# Altium project radxa_cm3_io_board_v1360_schematic.PrjPcb (part 2 of 5)

## Sheet 09.LCD_eDP TX.SchDoc: CM3 IO
size 297 x 209 mm; Page Create Date: March  8, 1995; Page Number: 09; Page Size: A4; Comment: radxa_1010; Page Count: 20; RevCode: 1.36; Doc: LCD_eDP TX; DsnPath: D:\WMS\黄工\[RC119]CM3_IO_V1.36\对外资料\radxa_cm3_io_board_v1360.DSN; SchematicName: CM3_IO V1.36; PageName: 09.LCD_eDP TX; PageSize: A4; TopSchematic: True
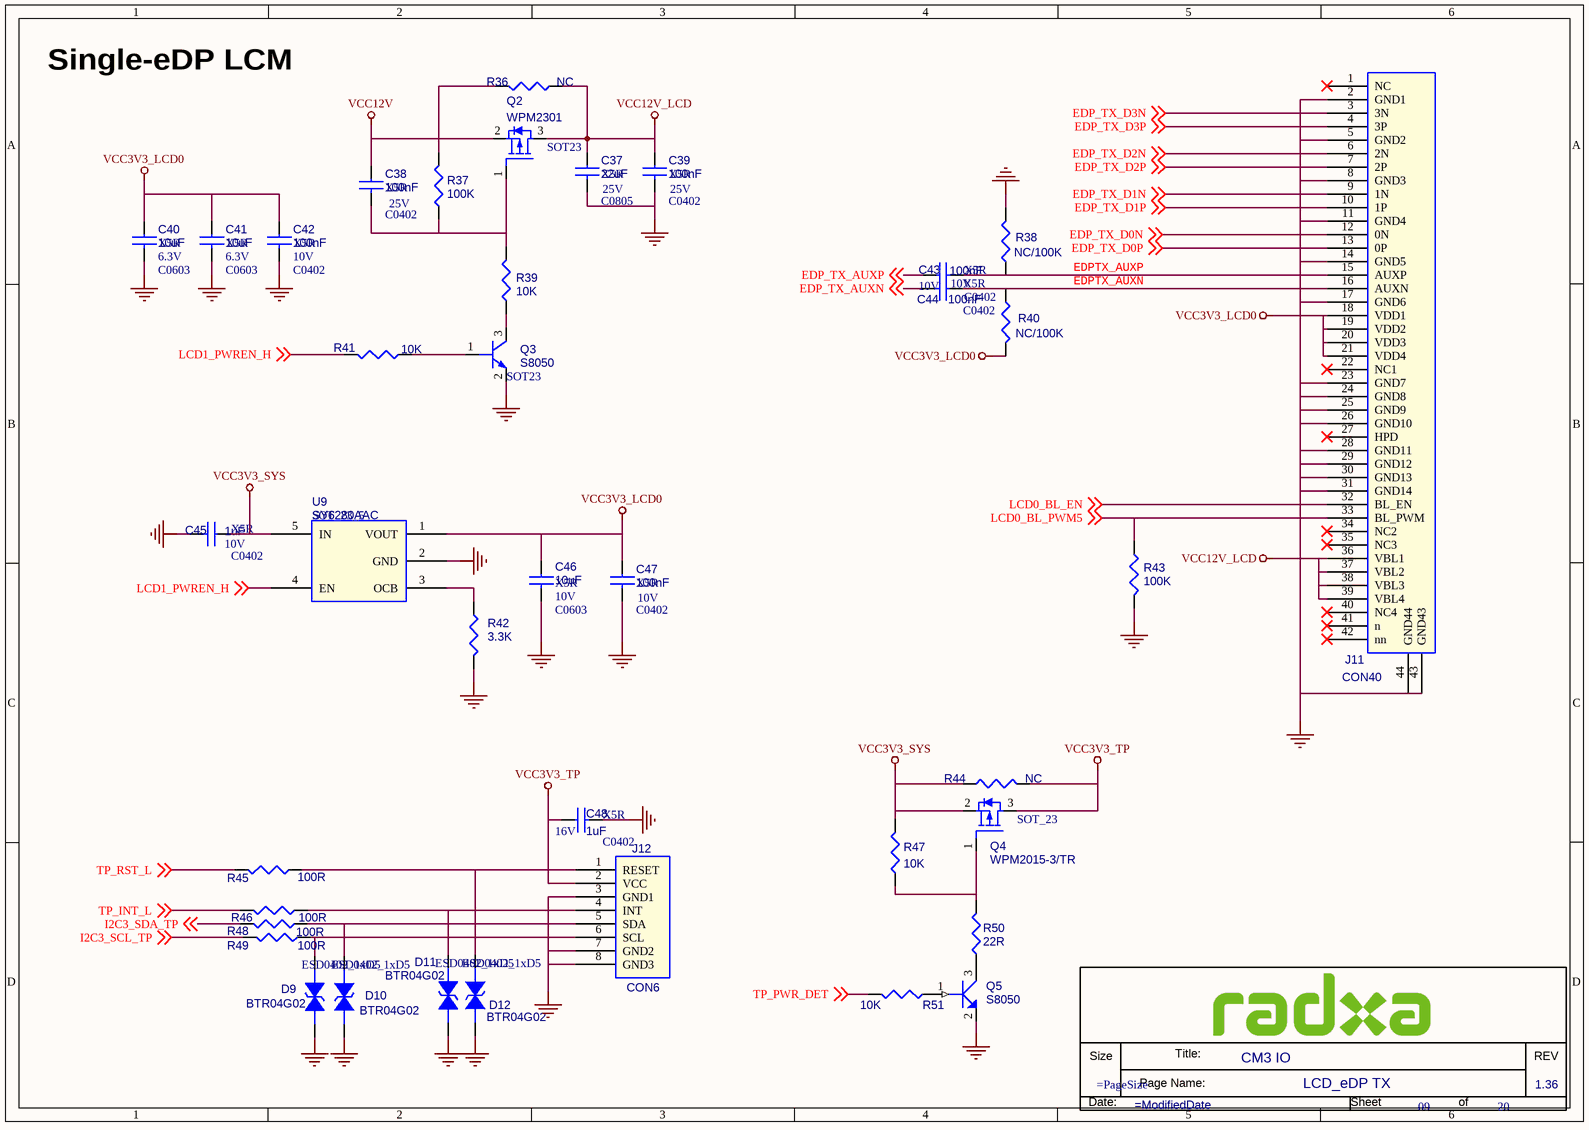
[diagram p7: 09.LCD_eDP TX.SchDoc]

### Parts
(Parts that share a designator on the sheet are numbered #1, #2 ... from top to bottom, then left to right.)
*#8  Doc: LCD_eDP TX  RevCode: 1.36  Title: CM3 IO  Page Number: 09  Page Count: 20  (hidden comment: radxa_1010)  (graphical)
C37  22uF  Voltage: 25V  Dielectric: X5R  [C0805]
C38  100nF  Voltage: 25V  Dielectric: X5R  [C0402]
C39  100nF  Voltage: 25V  Dielectric: X5R  [C0402]
C40  10uF  Voltage: 6.3V  Dielectric: X5R  [C0603]
C41  10uF  Voltage: 6.3V  Dielectric: X5R  [C0603]
C42  100nF  Voltage: 10V  Dielectric: X5R  [C0402]
C43  100nF  Voltage: 10V  Dielectric: X5R  [C0402]
C44  100nF  Voltage: 10V  Dielectric: X5R  [C0402]
C45  1uF  Voltage: 10V  Dielectric: X5R  [C0402]
C46  10uF  Voltage: 10V  Dielectric: X5R  [C0603]
C47  100nF  Voltage: 10V  Dielectric: X5R  [C0402]
C48  1uF  Voltage: 16V  Dielectric: X5R  [C0402]
D9  BTR04G02  [ESD0402_1xD5]
D10  BTR04G02  [ESD0402_1xD5]
D11  BTR04G02  [ESD0402_1xD5]
D12  BTR04G02  [ESD0402_1xD5]
J11  CON40  [20455-040E-TOP]
J12  CON6  [FPC6-0.5MM-2660H]
Q2  WPM2301  [SOT23]
Q3  S8050  [SOT23]
Q4  WPM2015-3/TR  PCB Footprint: SOT_23  [SOT23]
Q5  S8050  [SOT23]
R36  NC  [R0603]
R37  100K  [R0402]
R38  NC/100K  [R0402]
R39  10K  [R0402]
R40  NC/100K  [R0402]
R41  10K  [R0402]
R42  3.3K  [R0402]
R43  100K  [R0402]
R44  NC  [R0402]
R45  100R  [R0402]
R46  100R  [R0402]
R47  10K  [R0402]
R48  100R  [R0402]
R49  100R  [R0402]
R50  22R  [R0402]
R51  10K  [R0402]
U9  SY6280AAC  [SOT_23_5]

### Nets
GND: C37.2 C39.2 C40.2 C41.2 C42.2 C45.2 C46.2 C47.2 C48.2 D9.1 D10.1 D11.1 D12.1 J11.2(GND1) J11.5(GND2) J11.8(GND3) J11.11(GND4) J11.14(GND5) J11.17(GND6) J11.23(GND7) J11.24(GND8) J11.25(GND9) J11.26(GND10) J11.28(GND11) J11.29(GND12) J11.30(GND13) J11.31(GND14) J11.43(GND43) J11.44(GND44) J12.3(GND1) J12.7(GND2) J12.8(GND3) Q3.2(EMITTER) Q5.2(E) R38.1 R42.2 R43.2 U9.2(GND)
VCC3V3_LCD0: C40.1 C41.1 C42.1 C46.1 C47.1 J11.18(VDD1) J11.19(VDD2) J11.20(VDD3) J11.21(VDD4) R40.2 U9.1(VOUT)
VCC3V3_SYS: C45.1 Q4.2(SOURCE) R44.1 R47.2 U9.5(IN)
VCC3V3_TP: C48.1 J12.2(VCC) Q4.3(DRAIN) R44.2
VCC12V: C38.1 Q2.2(SOURCE) R36.1 R37.1
VCC12V_LCD: C37.1 C39.1 J11.36(VBL1) J11.37(VBL2) J11.38(VBL3) J11.39(VBL4) Q2.3(DRAIN) R36.2
EDP_TX_AUXN: C44.2 ; off-sheet EDP_TX_AUXN
EDP_TX_AUXP: C43.1 ; off-sheet EDP_TX_AUXP
EDP_TX_D0N: J11.12(0N) ; off-sheet EDP_TX_D0N
EDP_TX_D0P: J11.13(0P) ; off-sheet EDP_TX_D0P
EDP_TX_D1N: J11.9(1N) ; off-sheet EDP_TX_D1N
EDP_TX_D1P: J11.10(1P) ; off-sheet EDP_TX_D1P
EDP_TX_D2N: J11.6(2N) ; off-sheet EDP_TX_D2N
EDP_TX_D2P: J11.7(2P) ; off-sheet EDP_TX_D2P
EDP_TX_D3N: J11.3(3N) ; off-sheet EDP_TX_D3N
EDP_TX_D3P: J11.4(3P) ; off-sheet EDP_TX_D3P
EDPTX_AUXN: C44.1 J11.16(AUXN) R40.1
EDPTX_AUXP: C43.2 J11.15(AUXP) R38.2
I2C3_SCL_TP: R49.1 ; off-sheet I2C3_SCL_TP
I2C3_SDA_TP: R48.1 ; off-sheet I2C3_SDA_TP
LCD0_BL_EN: J11.32(BL_EN) ; off-sheet LCD0_BL_EN
LCD0_BL_PWM5: J11.33(BL_PWM) R43.1 ; off-sheet LCD0_BL_PWM5
LCD1_PWREN_H: R41.1 U9.4(EN) ; off-sheet LCD1_PWREN_H
TP_INT_L: R46.1 ; off-sheet TP_INT_L
TP_PWR_DET: R51.2 ; off-sheet TP_PWR_DET
TP_RST_L: R45.1 ; off-sheet TP_RST_L
NetC38_2: C38.2 Q2.1(GATE) R37.2 R39.1
NetD9_2: D9.2 J12.6(SCL) R49.2
NetD10_2: D10.2 J12.5(SDA) R48.2
NetD11_2: D11.2 J12.4(INT) R46.2
NetD12_2: D12.2 J12.1(RESET) R45.2
NetQ3_1: Q3.1(BASE) R41.2
NetQ3_3: Q3.3(COLLECTOR) R39.2
NetQ4_1: Q4.1(GATE) R47.1 R50.2
NetQ5_1: Q5.1(B) R51.1
NetQ5_3: Q5.3(C) R50.1
NetR42_1: R42.1 U9.3(OCB)

Not connected (* = marked no-connect by the designer): J11 1(NC)* 22(NC1)* 27(HPD)* 34(NC2)* 35(NC3)* 40(NC4)* 41(n)* 42(nn)*

### Notes on the sheet
- Single-eDP LCM
- (in symbol radxa_1010) Title:; Size; REV; Page Name:; Date:; Sheet; of

### Library data of the parts
C37 = CAP NP_0: cap,10.00uF,+/-10%,6.3V,X5R,C0603; Part Reference: C37; Manufacturer PN: C1608X5R0J106K080AB; Manufacturer: TDK; Tolerance: 10%; Priority: A; PCB Footprint: C0805; Value: 22uF; Created by: JJJ; Part Type: C0603; RK PN: C1608X5R0J106K080AB
C38 = CAP NP_0: cap,100.00nF,+/-10%,16V,X5R,C0402; Part Reference: C38; Manufacturer: TDK; RK PN: C1005X5R1C104K050BA; Priority: A; Tolerance: 10%; PCB Footprint: C0402; Value: 100nF; Part Type: C0402; Manufacturer PN: C1005X5R1C104K050BA; Created by: JJJ
C39 = CAP NP_0: cap,100.00nF,+/-10%,16V,X5R,C0402; Part Reference: C39; Manufacturer PN: C1005X5R1C104K050BA; Manufacturer: TDK; Tolerance: 10%; Priority: A; PCB Footprint: C0402; Value: 100nF; Created by: JJJ; Part Type: C0402; RK PN: C1005X5R1C104K050BA
C40 = CAP NP_0: cap,10.00uF,+/-10%,6.3V,X5R,C0603; Part Reference: C40; Manufacturer: TDK; RK PN: C1608X5R0J106K080AB; Priority: A; Tolerance: 10%; PCB Footprint: C0603; Value: 10uF; Part Type: C0603; C_Voltage: 6.3V; Manufacturer PN: C1608X5R0J106K080AB; Created by: JJJ
C41 = CAP NP_0: cap,10.00uF,+/-10%,6.3V,X5R,C0603; Part Reference: C41; Manufacturer: TDK; RK PN: C1608X5R0J106K080AB; Priority: A; Tolerance: 10%; PCB Footprint: C0603; Value: 10uF; Part Type: C0603; C_Voltage: 6.3V; Manufacturer PN: C1608X5R0J106K080AB; Created by: JJJ
C42 = CAP NP_0: cap,100.00nF,+/-10%,10V,X5R,C0402; Part Reference: C42; Manufacturer PN: C1005X5R1A104K050BA; Manufacturer: TDK; Tolerance: 10%; Priority: A; PCB Footprint: C0402; Value: 100nF; Created by: JJJ; Part Type: C0402; RK PN: C1005X5R1A104K050BA
C43 = CAP NP_0: cap,100.00nF,+/-10%,10V,X5R,C0402; Part Reference: C43; Manufacturer PN: C1005X5R1A104K050BA; Manufacturer: TDK; Tolerance: 10%; Priority: A; PCB Footprint: C0402; Value: 100nF; Created by: JJJ; Part Type: C0402; RK PN: C1005X5R1A104K050BA
C44 = CAP NP_0: cap,100.00nF,+/-10%,10V,X5R,C0402; Part Reference: C44; Manufacturer PN: C1005X5R1A104K050BA; Manufacturer: TDK; Tolerance: 10%; Priority: A; PCB Footprint: C0402; Value: 100nF; Created by: JJJ; Part Type: C0402; RK PN: C1005X5R1A104K050BA
C45 = CAP NP_0: cap,1.00uF,+/-10%,10V,X5R,C0402; Part Reference: C45; Manufacturer PN: C1005X5R1A105K050BB; Manufacturer: TDK; Tolerance: 10%; C_Voltage: 6.3V; Priority: A; PCB Footprint: C0402; Value: 1uF; Created by: JJJ; Part Type: C0402; RK PN: C1005X5R1A105K050BB
C46 = CAP NP_0: cap,10.00uF,+/-10%,10V,X5R,C0603; Part Reference: C46; Manufacturer: TDK; RK PN: C1608X5R1A106K080AC; Priority: A; Tolerance: 10%; PCB Footprint: C0603; Value: 10uF; Part Type: C0603; Manufacturer PN: C1608X5R1A106K080AC; Created by: JJJ
C47 = CAP NP_0: cap,100.00nF,+/-10%,10V,X5R,C0402; Part Reference: C47; Manufacturer: TDK; RK PN: C1005X5R1A104K050BA; Priority: A; Tolerance: 10%; PCB Footprint: C0402; Value: 100nF; Part Type: C0402; Manufacturer PN: C1005X5R1A104K050BA; Created by: JJJ
C48 = CAP NP_0: cap,100.00nF,+/-10%,6.3V,X5R,C0402; Part Reference: C48; Manufacturer: TDK; RK PN: C1005X5R0J104K050BA; Priority: A; Tolerance: 10%; PCB Footprint: C0402; Value: 1uF; Part Type: C0402; Manufacturer PN: C1005X5R0J104K050BA; Created by: JJJ
D9 = DIODE BI_DIR TRIG_0: 1-Line, Bi-directional, Transient Voltage Suppressors.17.5pF.; Part Reference: D9; Manufacturer PN: ESD5451N; Manufacturer: WillSemi(韦尔半导体); OPTION: DNP; Priority: A; PCB Footprint: ESD0402_1xD5; Value: BTR04G02; Created by: JJJ; Part Type: ESD_TVS; RK PN: ESD5451N
D10 = DIODE BI_DIR TRIG_0: 1-Line, Bi-directional, Transient Voltage Suppressors.17.5pF.; Part Reference: D10; Manufacturer: WillSemi(韦尔半导体); RK PN: ESD5451N; Priority: A; OPTION: DNP; PCB Footprint: ESD0402_1xD5; Value: BTR04G02; Part Type: ESD_TVS; Manufacturer PN: ESD5451N; Created by: JJJ
D11 = DIODE BI_DIR TRIG_0: 1-Line, Bi-directional, Transient Voltage Suppressors.17.5pF.; Part Reference: D11; Manufacturer: WillSemi(韦尔半导体); RK PN: ESD5451N; Priority: A; OPTION: DNP; PCB Footprint: ESD0402_1xD5; Value: BTR04G02; Part Type: ESD_TVS; Manufacturer PN: ESD5451N; Created by: JJJ
D12 = DIODE BI_DIR TRIG_0: 1-Line, Bi-directional, Transient Voltage Suppressors.17.5pF.; Part Reference: D12; Manufacturer: WillSemi(韦尔半导体); RK PN: ESD5451N; Priority: A; OPTION: DNP; PCB Footprint: ESD0402_1xD5; Value: BTR04G02; Part Type: ESD_TVS; Manufacturer PN: ESD5451N; Created by: JJJ
J11 = CON40_1: Part Reference: J11; Value: CON40; PCB Footprint: 20455-040E-TOP
J12 = CON6_1: Part Reference: J12; Value: CON6; PCB Footprint: FPC6-0.5MM-2660H
Q2 = MOSFET P: PMOS,WPM3407-3/TR,SOT_23,Id=4.4A,Vds=30V; Part Reference: Q2; Manufacturer: WillSemi(韦尔半导体); Priority: A; Id_max: 4.4A; Vgs: ±20V; VDS: 30V; Vgsth: 2.0V; Pd: 0.9W; PCB Footprint: SOT23; Value: WPM2301; RK PN: WPM3407-3/TR; Part Type: PMOS; Manufacturer PN: WPM3407-3/TR; Created by: JJJ
Q3 = NPN: S8050,SOT23; Part Reference: Q3; Manufacturer: 长电; Manufacturer PN: S8050_SOT23; Priority: A; Ic: 0.5A; Vceo: 25V; Pc: 0.3W; PCB Footprint: SOT23; Value: S8050; RK PN: S8050; Part Type: NPN; Created by: JJJ
Q4 = MOSFET P: PMOS,WPM2015-3/TR,SOT_23,Id=2.4A,Vds=20V; Part Reference: Q4; Manufacturer: WillSemi(韦尔半导体); ROOM: CHG; Priority: A; Id_max: 2.4A; Vgs: ±8V; VDS: 20V; Vgsth: 0.62V; Pd: 0.5W; option: DNP; Value: WPM2015-3/TR; RK PN: WPM2015-3/TR; Part Type: PMOS; Manufacturer PN: WPM2015-3/TR; Created by: JJJ
Q5 = NPN4: Part Reference: Q5; Value: S8050; PCB Footprint: SOT23
R36 = RESISTOR_0: 通用厚膜电阻,10K,+/-5%,R0402,1/16W.; Part Reference: R36; Manufacturer: YAGEO; RK PN: RC0402JR-0710KL; Priority: A; Tolerance: 5%; Wattage: 1/16W; Value: NC; Part Type: 通用厚膜电阻; Manufacturer PN: RC0402JR-0710KL; Created by: YTL; PCB Footprint: R0603
R37 = RESISTOR_0: 通用厚膜电阻,100K,+/-5%,R0402,1/16W.; Part Reference: R37; Manufacturer: YAGEO; RK PN: RC0402JR-07100KL; Priority: A; Tolerance: 5%; Wattage: 1/16W; Value: 100K; Part Type: 通用厚膜电阻; Manufacturer PN: RC0402JR-07100KL; Created by: YTL; PCB Footprint: R0402
R38 = RESISTOR_0: 通用厚膜电阻,100K,+/-5%,R0402,1/16W.; Part Reference: R38; Manufacturer PN: RC0402JR-07100KL; Manufacturer: YAGEO; Option: DNP; Wattage: 1/16W; Tolerance: 5%; Priority: A; Value: NC/100K; Created by: YTL; Part Type: 通用厚膜电阻; RK PN: RC0402JR-07100KL; PCB Footprint: R0402
R39 = RESISTOR_0: 通用厚膜电阻,10K,+/-5%,R0402,1/16W.; Part Reference: R39; Manufacturer PN: RC0402JR-0710KL; Manufacturer: YAGEO; Wattage: 1/16W; Tolerance: 5%; Priority: A; Value: 10K; Created by: YTL; Part Type: 通用厚膜电阻; RK PN: RC0402JR-0710KL; PCB Footprint: R0402
R40 = RESISTOR_0: 通用厚膜电阻,100K,+/-5%,R0402,1/16W.; Part Reference: R40; Manufacturer: YAGEO; Option: DNP; RK PN: RC0402JR-07100KL; Priority: A; Tolerance: 5%; Wattage: 1/16W; Value: NC/100K; Part Type: 通用厚膜电阻; Manufacturer PN: RC0402JR-07100KL; Created by: YTL; PCB Footprint: R0402
R41 = RESISTOR_0: 通用厚膜电阻,10K,+/-5%,R0402,1/16W.; Part Reference: R41; Manufacturer: YAGEO; RK PN: RC0402JR-0710KL; Priority: A; Tolerance: 5%; Wattage: 1/16W; Value: 10K; Part Type: 通用厚膜电阻; Manufacturer PN: RC0402JR-0710KL; Created by: YTL; PCB Footprint: R0402
R42 = RESISTOR_0: 通用厚膜电阻,4K7,+/-5%,R0402,1/16W.; Part Reference: R42; Manufacturer PN: RC0402JR-074K7L; Manufacturer: YAGEO; Wattage: 1/16W; Tolerance: 5%; Priority: A; Value: 3.3K; Created by: YTL; Part Type: 通用厚膜电阻; RK PN: RC0402JR-074K7L; PCB Footprint: R0402
R43 = RESISTOR_0: 通用厚膜电阻,100K,+/-5%,R0402,1/16W.; Part Reference: R43; Manufacturer: YAGEO; RK PN: RC0402JR-07100KL; Priority: A; Tolerance: 5%; Wattage: 1/16W; Value: 100K; Part Type: 通用厚膜电阻; Manufacturer PN: RC0402JR-07100KL; Created by: YTL; PCB Footprint: R0402
R44 = RESISTOR_0: 通用厚膜电阻,0R,+/-5%,R0402,1/16W.; Part Reference: R44; Manufacturer: YAGEO; RK PN: RC0402JR-070RL; Priority: A; Tolerance: 5%; Wattage: 1/16W; Value: NC; Part Type: 通用厚膜电阻; Manufacturer PN: RC0402JR-070RL; Created by: YTL; PCB Footprint: R0402
R45 = RESISTOR_0: 通用厚膜电阻,100K,+/-5%,R0402,1/16W.; Part Reference: R45; Manufacturer: YAGEO; RK PN: RC0402JR-07100KL; Priority: A; Tolerance: 5%; Wattage: 1/16W; Value: 100R; Part Type: 通用厚膜电阻; Manufacturer PN: RC0402JR-07100KL; Created by: YTL; PCB Footprint: R0402
R46 = RESISTOR_0: 通用厚膜电阻,100K,+/-5%,R0402,1/16W.; Part Reference: R46; Manufacturer PN: RC0402JR-07100KL; Manufacturer: YAGEO; Wattage: 1/16W; Tolerance: 5%; Priority: A; Value: 100R; Created by: YTL; Part Type: 通用厚膜电阻; RK PN: RC0402JR-07100KL; PCB Footprint: R0402
R47 = RESISTOR_0: 通用厚膜电阻,10K,+/-5%,R0402,1/16W.; Part Reference: R47; Manufacturer PN: RC0402JR-0710KL; Manufacturer: YAGEO; Wattage: 1/16W; Tolerance: 5%; Priority: A; Value: 10K; Created by: YTL; Part Type: 通用厚膜电阻; RK PN: RC0402JR-0710KL; PCB Footprint: R0402
R48 = RESISTOR_0: 通用厚膜电阻,100K,+/-5%,R0402,1/16W.; Part Reference: R48; Manufacturer PN: RC0402JR-07100KL; Manufacturer: YAGEO; Wattage: 1/16W; Tolerance: 5%; Priority: A; Value: 100R; Created by: YTL; Part Type: 通用厚膜电阻; RK PN: RC0402JR-07100KL; PCB Footprint: R0402
R49 = RESISTOR_0: 通用厚膜电阻,100K,+/-5%,R0402,1/16W.; Part Reference: R49; Manufacturer: YAGEO; RK PN: RC0402JR-07100KL; Priority: A; Tolerance: 5%; Wattage: 1/16W; Value: 100R; Part Type: 通用厚膜电阻; Manufacturer PN: RC0402JR-07100KL; Created by: YTL; PCB Footprint: R0402
R50 = RESISTOR_0: Part Reference: R50; Value: 22R; PCB Footprint: R0402
R51 = RESISTOR_0: 通用厚膜电阻,100K,+/-5%,R0402,1/16W.; Part Reference: R51; Manufacturer PN: RC0402JR-07100KL; Manufacturer: YAGEO; Wattage: 1/16W; Tolerance: 5%; Priority: A; Value: 10K; Created by: YTL; Part Type: 通用厚膜电阻; RK PN: RC0402JR-07100KL; PCB Footprint: R0402
U9 = SWITCH_SY6280: Low Loss Power Distribution Switch; Part Reference: U9; Manufacturer: Silergy（矽力杰）; Priority: A; PCB Footprint: SOT_23_5; Value: SY6280AAC; Created by: JJJ; Manufacturer PN: SY6280AAC; Part Type: Switch; RK PN: SY6280AAC
*#8 = radxa_1010: Page Create Date: March  8, 1995; Page Size: =PageSize; Page Modify Date: =ModifiedDate

## Sheet 10.MIPI_LCD_TX0.SchDoc: CM3 IO
size 297 x 209 mm; Page Create Date: March  8, 1995; Page Number: 10; Page Size: A4; Comment: radxa_1010; Page Count: 20; RevCode: 1.36; Doc: MIPI_LCD_TX0; DsnPath: D:\WMS\黄工\[RC119]CM3_IO_V1.36\对外资料\radxa_cm3_io_board_v1360.DSN; SchematicName: CM3_IO V1.36; PageName: 10.MIPI_LCD_TX0; PageSize: A4; TopSchematic: True
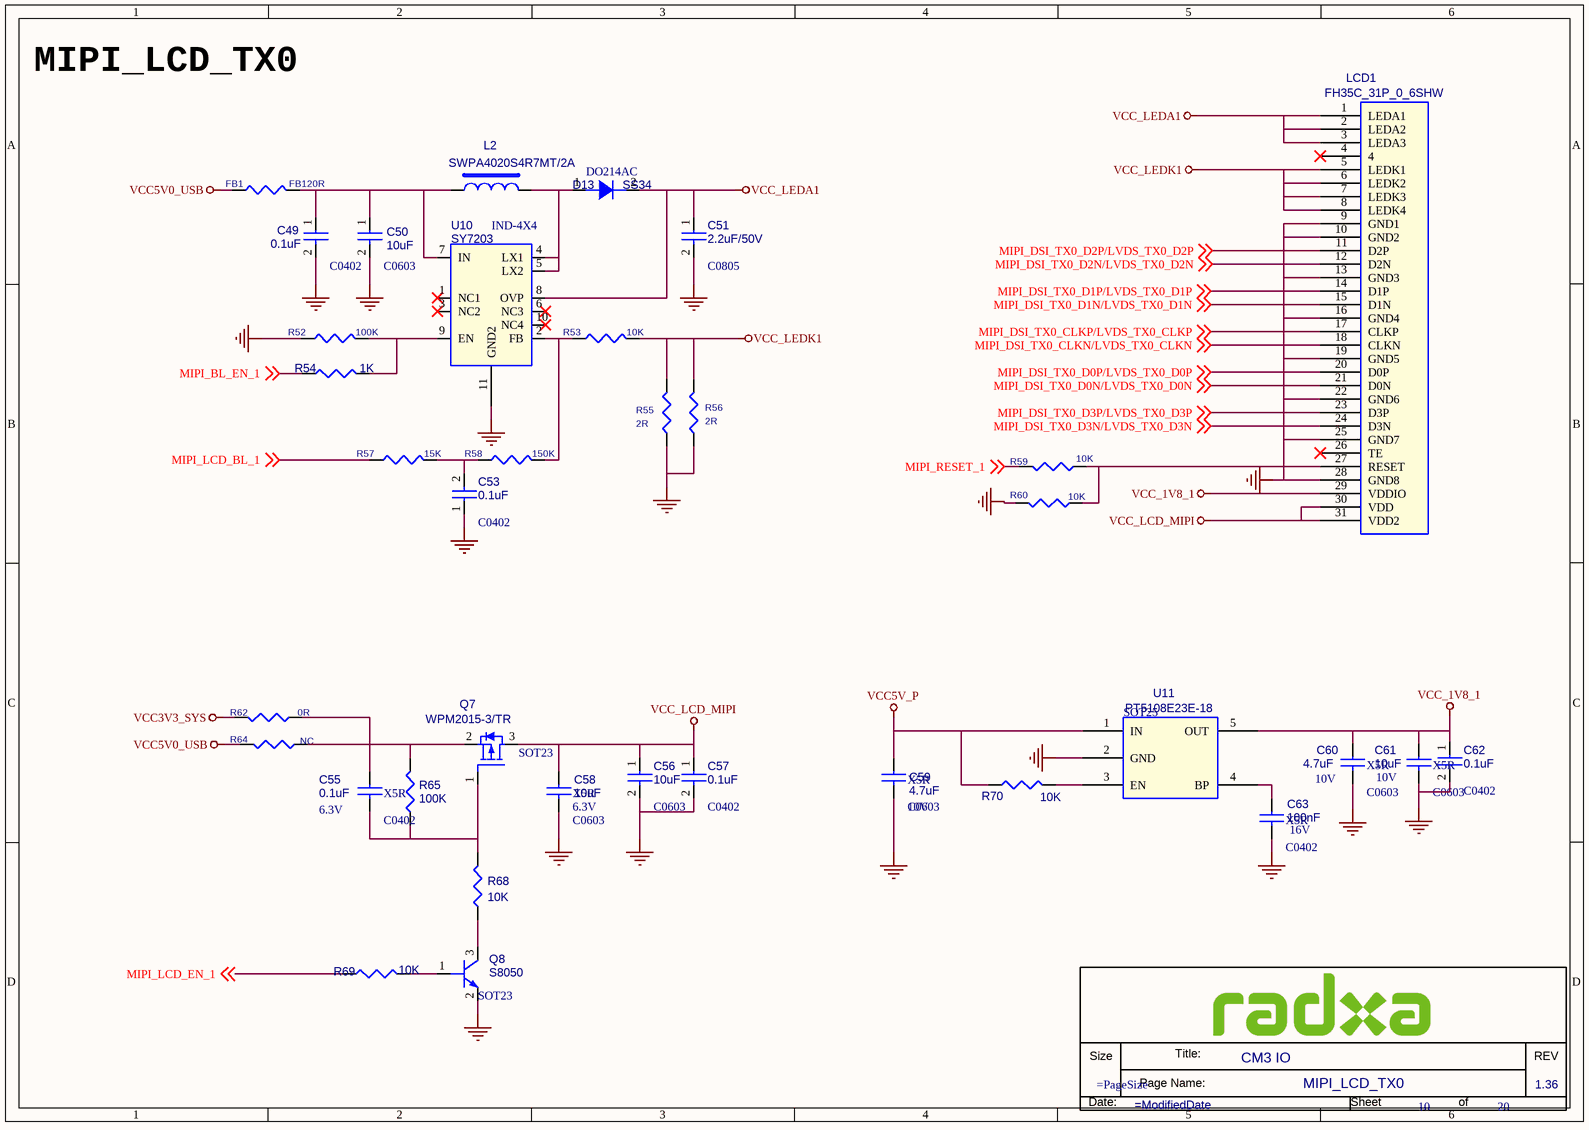
[diagram p8: 10.MIPI_LCD_TX0.SchDoc]

### Parts
(Parts that share a designator on the sheet are numbered #1, #2 ... from top to bottom, then left to right.)
*#9  Doc: MIPI_LCD_TX0  RevCode: 1.36  Title: CM3 IO  Page Number: 10  Page Count: 20  (hidden comment: radxa_1010)  (graphical)
C49  0.1uF  [C0402]
C50  10uF  [C0603]
C51  2.2uF/50V  [C0805]
C53  0.1uF  [C0402]
C55  0.1uF  Voltage: 6.3V  Dielectric: X5R  [C0402]
C56  10uF  [C0603]
C57  0.1uF  [C0402]
C58  10uF  Voltage: 6.3V  Dielectric: X5R  [C0603]
C59  4.7uF  Voltage: 10V  Dielectric: X5R  [C0603]
C60  4.7uF  Voltage: 10V  Dielectric: X5R  [C0603]
C61  10uF  Voltage: 10V  Dielectric: X5R  [C0603]
C62  0.1uF  [C0402]
C63  100nF  Voltage: 16V  Dielectric: X5R  [C0402]
D13  SS34  [DO214AC]
FB1  FB120R  [R0603]
L2  SWPA4020S4R7MT/2A  [IND-4X4]
LCD1  FH35C_31P_0_6SHW  [HQ101WX001]
Q7  WPM2015-3/TR  [SOT23]
Q8  S8050  [SOT23]
R52  100K  [R0402]
R53  10K  [R0402]
R54  1K  [R0402]
R55  2R  [R0805]
R56  2R  [R0805]
R57  15K  [R0402]
R58  150K  [R0402]
R59  10K  [R0402]
R60  10K  [R0402]
R62  0R  [R0603]
R64  NC  [R0603]
R65  100K  [R0402]
R68  10K  [R0402]
R69  10K  [R0402]
R70  10K  [R0402]
U10  SY7203  [QFN8-2X2]
U11  PT5108E23E-18  [SOT25]

### Nets
GND: C49.2 C50.2 C51.2 C53.1 C56.2 C57.2 C58.2 C59.2 C60.2 C61.2 C62.2 C63.2 LCD1.9(GND1) LCD1.10(GND2) LCD1.13(GND3) LCD1.16(GND4) LCD1.19(GND5) LCD1.22(GND6) LCD1.25(GND7) LCD1.28(GND8) Q8.2(EMITTER) R52.1 R55.2 R56.2 R60.2 U10.11(GND2) U11.2(GND)
VCC3V3_SYS: R62.1
VCC5V0_USB: FB1.1 R64.1
VCC5V_P: C59.1 R70.1 U11.1(IN)
VCC_1V8_1: C60.1 C61.1 C62.1 LCD1.29(VDDIO) U11.5(OUT)
VCC_LCD_MIPI: C56.1 C57.1 C58.1 LCD1.30(VDD) LCD1.31(VDD2) Q7.3(DRAIN)
VCC_LEDA1: C51.1 D13.2(K) LCD1.1(LEDA1) LCD1.2(LEDA2) LCD1.3(LEDA3) U10.8(OVP)
VCC_LEDK1: LCD1.5(LEDK1) LCD1.6(LEDK2) LCD1.7(LEDK3) LCD1.8(LEDK4) R53.2 R55.1 R56.1
MIPI_BL_EN_1: R54.1 ; off-sheet MIPI_BL_EN_1
MIPI_DSI_TX0_CLKN/LVDS_TX0_CLKN: LCD1.18(CLKN) ; off-sheet MIPI_DSI_TX0_CLKN/LVDS_TX0_CLKN
MIPI_DSI_TX0_CLKP/LVDS_TX0_CLKP: LCD1.17(CLKP) ; off-sheet MIPI_DSI_TX0_CLKP/LVDS_TX0_CLKP
MIPI_DSI_TX0_D0N/LVDS_TX0_D0N: LCD1.21(D0N) ; off-sheet MIPI_DSI_TX0_D0N/LVDS_TX0_D0N
MIPI_DSI_TX0_D0P/LVDS_TX0_D0P: LCD1.20(D0P) ; off-sheet MIPI_DSI_TX0_D0P/LVDS_TX0_D0P
MIPI_DSI_TX0_D1N/LVDS_TX0_D1N: LCD1.15(D1N) ; off-sheet MIPI_DSI_TX0_D1N/LVDS_TX0_D1N
MIPI_DSI_TX0_D1P/LVDS_TX0_D1P: LCD1.14(D1P) ; off-sheet MIPI_DSI_TX0_D1P/LVDS_TX0_D1P
MIPI_DSI_TX0_D2N/LVDS_TX0_D2N: LCD1.12(D2N) ; off-sheet MIPI_DSI_TX0_D2N/LVDS_TX0_D2N
MIPI_DSI_TX0_D2P/LVDS_TX0_D2P: LCD1.11(D2P) ; off-sheet MIPI_DSI_TX0_D2P/LVDS_TX0_D2P
MIPI_DSI_TX0_D3N/LVDS_TX0_D3N: LCD1.24(D3N) ; off-sheet MIPI_DSI_TX0_D3N/LVDS_TX0_D3N
MIPI_DSI_TX0_D3P/LVDS_TX0_D3P: LCD1.23(D3P) ; off-sheet MIPI_DSI_TX0_D3P/LVDS_TX0_D3P
MIPI_LCD_BL_1: R57.1 ; off-sheet MIPI_LCD_BL_1
MIPI_LCD_EN_1: R69.1 ; off-sheet MIPI_LCD_EN_1
MIPI_RESET_1: R59.2 ; off-sheet MIPI_RESET_1
NetC49_1: C49.1 C50.1 FB1.2 L2.1 U10.7(IN)
NetC53_2: C53.2 R57.2 R58.1
NetC55_1: C55.1 Q7.2(SOURCE) R62.2 R64.2 R65.1
NetC55_2: C55.2 Q7.1(GATE) R65.2 R68.1
NetC63_1: C63.1 U11.4(BP)
NetD13_1: D13.1(A) L2.2 U10.4(LX1) U10.5(LX2)
NetLCD1_27: LCD1.27(RESET) R59.1 R60.1
NetQ8_1: Q8.1(BASE) R69.2
NetQ8_3: Q8.3(COLLECTOR) R68.2
NetR52_2: R52.2 R54.2 U10.9(EN)
NetR53_1: R53.1 R58.2 U10.2(FB)
NetR70_2: R70.2 U11.3(EN)

Not connected (* = marked no-connect by the designer): LCD1 4* 26(TE)*; U10 1(NC1)* 3(NC2)* 6(NC3)* 10(NC4)*

### Notes on the sheet
- MIPI_LCD_TX0
- (in symbol radxa_1010) Title:; Size; REV; Page Name:; Date:; Sheet; of

### Library data of the parts
C49 = CAP NP: CAP,MLCC,100nF,+/-10%,X7R,6.3V,SMD0402; Part Reference: C49; PCB Footprint: C0402; Value: 0.1uF
C50 = CAP NP: Part Reference: C50; PCB Footprint: C0603; Value: 10uF
C51 = CAP NP: RoHS CHIP CAP 1uF +10/-10% 25V X5R; Part Reference: C51; PCB Footprint: C0805; Value: 2.2uF/50V
C53 = CAP NP: RoHS CHIP CAP 0.1uF +10/-10% X7R; Part Reference: C53; PCB Footprint: C0402; Value: 0.1uF
C55 = CAP NP_0: cap,100.00nF,+/-10%,6.3V,X5R,C0402; Part Reference: C55; Manufacturer PN: C1005X5R0J104K050BA; Manufacturer: TDK; Tolerance: 10%; Priority: A; PCB Footprint: C0402; Value: 0.1uF; Created by: JJJ; Part Type: C0402; RK PN: C1005X5R0J104K050BA
C56 = CAP NP: CAP,MLCC,4.7uF,+/-10%,X5R,6.3V,SMD0603; Part Reference: C56; PCB Footprint: C0603; Value: 10uF
C57 = CAP NP: CAP,MLCC,100nF,+/-10%,X7R,6.3V,SMD0402; Part Reference: C57; PCB Footprint: C0402; Value: 0.1uF
C58 = CAP NP_0: cap,4.70uF,+/-10%,6.3V,X5R,C0603; Part Reference: C58; Manufacturer PN: C1608X5R0J475K080AB; Manufacturer: TDK; Tolerance: 10%; Priority: A; PCB Footprint: C0603; Value: 10uF; Created by: JJJ; Part Type: C0603; RK PN: C1608X5R0J475K080AB
C59 = CAP NP_0: cap,4.70uF,+/-10%,10V,X5R,C0603; Part Reference: C59; Manufacturer PN: C1608X5R1A475K080AC; Manufacturer: TDK; Tolerance: 10%; Priority: A; PCB Footprint: C0603; Value: 4.7uF; Created by: JJJ; Part Type: C0603; RK PN: C1608X5R1A475K080AC
C60 = CAP NP_0: cap,4.70uF,+/-10%,10V,X5R,C0603; Part Reference: C60; Manufacturer PN: C1608X5R1A475K080AC; Manufacturer: TDK; Tolerance: 10%; Priority: A; PCB Footprint: C0603; Value: 4.7uF; Created by: JJJ; Part Type: C0603; RK PN: C1608X5R1A475K080AC
C61 = CAP NP_0: cap,10.00uF,+/-10%,10V,X5R,C0805; Part Reference: C61; Manufacturer PN: C2012X5R1A106K125AB; Manufacturer: TDK; Tolerance: 10%; Priority: A; PCB Footprint: C0603; Value: 10uF; Created by: JJJ; Part Type: C0805; RK PN: C2012X5R1A106K125AB
C62 = CAP NP: CAP,MLCC,100nF,+/-10%,X7R,6.3V,SMD0402; Part Reference: C62; PCB Footprint: C0402; Value: 0.1uF
C63 = CAP NP_0: cap,100.00nF,+/-10%,16V,X5R,C0402; Part Reference: C63; Manufacturer: TDK; RK PN: C1005X5R1C104K050BA; Priority: A; Tolerance: 10%; PCB Footprint: C0402; Value: 100nF; Part Type: C0402; Manufacturer PN: C1005X5R1C104K050BA; Created by: JJJ
D13 = DIODE: Part Reference: D13; PCB Footprint: DO214AC; Value: SS34
FB1 = RES 1B: ROHS CHIP RES 4.7K 1/16W 5%; Part Reference: FB1; Value: FB120R; PCB Footprint: R0603
L2 = INDUCTORS OF FERRITE: Part Reference: L2; PCB Footprint: IND-4X4; Value: SWPA4020S4R7MT/2A
LCD1 = HQ101WX001: Part Reference: LCD1; PCB Footprint: FH35C_31P_0_6SHW_LCD; Value: FH35C_31P_0_6SHW
Q7 = MOSFET P: PMOS,WPM2015-3/TR,SOT23,Id=2.4A,Vds=20V; Part Reference: Q7; Manufacturer: WillSemi(韦尔半导体); Pd: 0.5W; Vgsth: 0.62V; VDS: 20V; Vgs: ±8V; Id: 2.4A; Priority: A; PCB Footprint: SOT23; Value: WPM2015-3/TR; Created by: JJJ; Manufacturer PN: WPM2015-3/TR; Part Type: PMOS; RK PN: WPM2015-3/TR
Q8 = NPN: S8050 SOT23; Part Reference: Q8; Manufacturer: 长电; Manufacturer PN: S8050_SOT23; Priority: A; Ic: 0.5A; Vceo: 25V; Pc: 0.3W; PCB Footprint: SOT23; Value: S8050; RK PN: S8050; Part Type: NPN; Created by: JJJ
R52 = RES 1B: ROHS CHIP RES 4.7K 1/16W 5%; Part Reference: R52; Value: 100K; PCB Footprint: R0402
R53 = RES 1B: ROHS CHIP RES 82K 1/16W 5%; Part Reference: R53; Value: 10K; PCB Footprint: R0402
R54 = RESISTOR_0: 通用厚膜电阻,10K,+/-5%,R0402,1/16W.; Part Reference: R54; Manufacturer: YAGEO; RK PN: RC0402JR-0710KL; Priority: A; Tolerance: 5%; Wattage: 1/16W; Value: 1K; Part Type: 通用厚膜电阻; Manufacturer PN: RC0402JR-0710KL; Created by: YTL; PCB Footprint: R0402
R55 = RES 1B: ROHS CHIP RES 4.7R 1/4W 5%; Part Reference: R55; Value: 2R; PCB Footprint: R0805
R56 = RES 1B: ROHS CHIP RES 4.7R 1/4W 5%; Part Reference: R56; Value: 2R; PCB Footprint: R0805
R57 = RES 1B: ROHS CHIP RES 4.7K 1/16W 5%; Part Reference: R57; Value: 15K; PCB Footprint: R0402
R58 = RES 1B: ROHS CHIP RES 4.7K 1/16W 5%; Part Reference: R58; Value: 150K; PCB Footprint: R0402
R59 = RES 1B: ROHS CHIP RES 4.7K 1/16W 5%; Part Reference: R59; Value: 10K; PCB Footprint: R0402
R60 = RES 1B: ROHS CHIP RES 4.7K 1/16W 5%; Part Reference: R60; Value: 10K; PCB Footprint: R0402
R62 = RES 1B: ROHS CHIP RES 4.7R 1/4W 5%; Part Reference: R62; Value: 0R; PCB Footprint: R0603
R64 = RES 1B: ROHS CHIP RES 4.7R 1/4W 5%; Part Reference: R64; Value: NC; PCB Footprint: R0603
R65 = RESISTOR_0: 通用厚膜电阻,100K,+/-5%,R0402,1/16W.; Part Reference: R65; Manufacturer PN: RC0402JR-07100KL; Manufacturer: YAGEO; Wattage: 1/16W; Tolerance: 5%; Priority: A; Value: 100K; Created by: YTL; Part Type: 通用厚膜电阻; RK PN: RC0402JR-07100KL; PCB Footprint: R0402
R68 = RESISTOR_0: 通用厚膜电阻,10K,+/-5%,R0402,1/16W.; Part Reference: R68; Manufacturer PN: RC0402JR-0710KL; Manufacturer: YAGEO; Wattage: 1/16W; Tolerance: 5%; Priority: A; Value: 10K; Created by: YTL; Part Type: 通用厚膜电阻; RK PN: RC0402JR-0710KL; PCB Footprint: R0402
R69 = RESISTOR_0: 通用厚膜电阻,10K,+/-5%,R0402,1/16W.; Part Reference: R69; Manufacturer PN: RC0402JR-0710KL; Manufacturer: YAGEO; Wattage: 1/16W; Tolerance: 5%; Priority: A; Value: 10K; Created by: YTL; Part Type: 通用厚膜电阻; RK PN: RC0402JR-0710KL; PCB Footprint: R0402
R70 = RESISTOR_0: 通用厚膜电阻,10K,+/-5%,R0402,1/16W.; Part Reference: R70; Manufacturer: YAGEO; RK PN: RC0402JR-0710KL; Priority: A; Tolerance: 5%; Wattage: 1/16W; Value: 10K; Part Type: 通用厚膜电阻; Manufacturer PN: RC0402JR-0710KL; Created by: YTL; PCB Footprint: R0402
U10 = MP3202-QFN8_1: Part Reference: U10; PCB Footprint: DFN10P_3X3; Value: SY7203
U11 = LDO_PT5108: 500mA, Low Dropout, Low Noise Ultra-Fast Without Bypass Capacitor CMOS LDO Regulator; Part Reference: U11; Manufacturer: Richtek（立錡）; Manufacturer PN: RT9013-30GB; Option: /CE75B30M; RK PN: RT9013-30B; Priority: A; PCB Footprint: SOT25; Value: PT5108E23E-18; Part Type: LDO; Created by: JJJ
*#9 = radxa_1010: Page Create Date: March  8, 1995; Page Size: =PageSize; Page Modify Date: =ModifiedDate

## Sheet 11.MIPI_CSI_RX.SchDoc: CM3 IO
size 297 x 209 mm; Page Create Date: March  8, 1995; Page Number: 11; Page Size: A4; Comment: radxa_1010; Page Count: 20; RevCode: 1.36; Doc: MIPI_CSI_RX; DsnPath: D:\WMS\黄工\[RC119]CM3_IO_V1.36\对外资料\radxa_cm3_io_board_v1360.DSN; SchematicName: CM3_IO V1.36; PageName: 11.MIPI_CSI_RX; PageSize: A4; TopSchematic: True
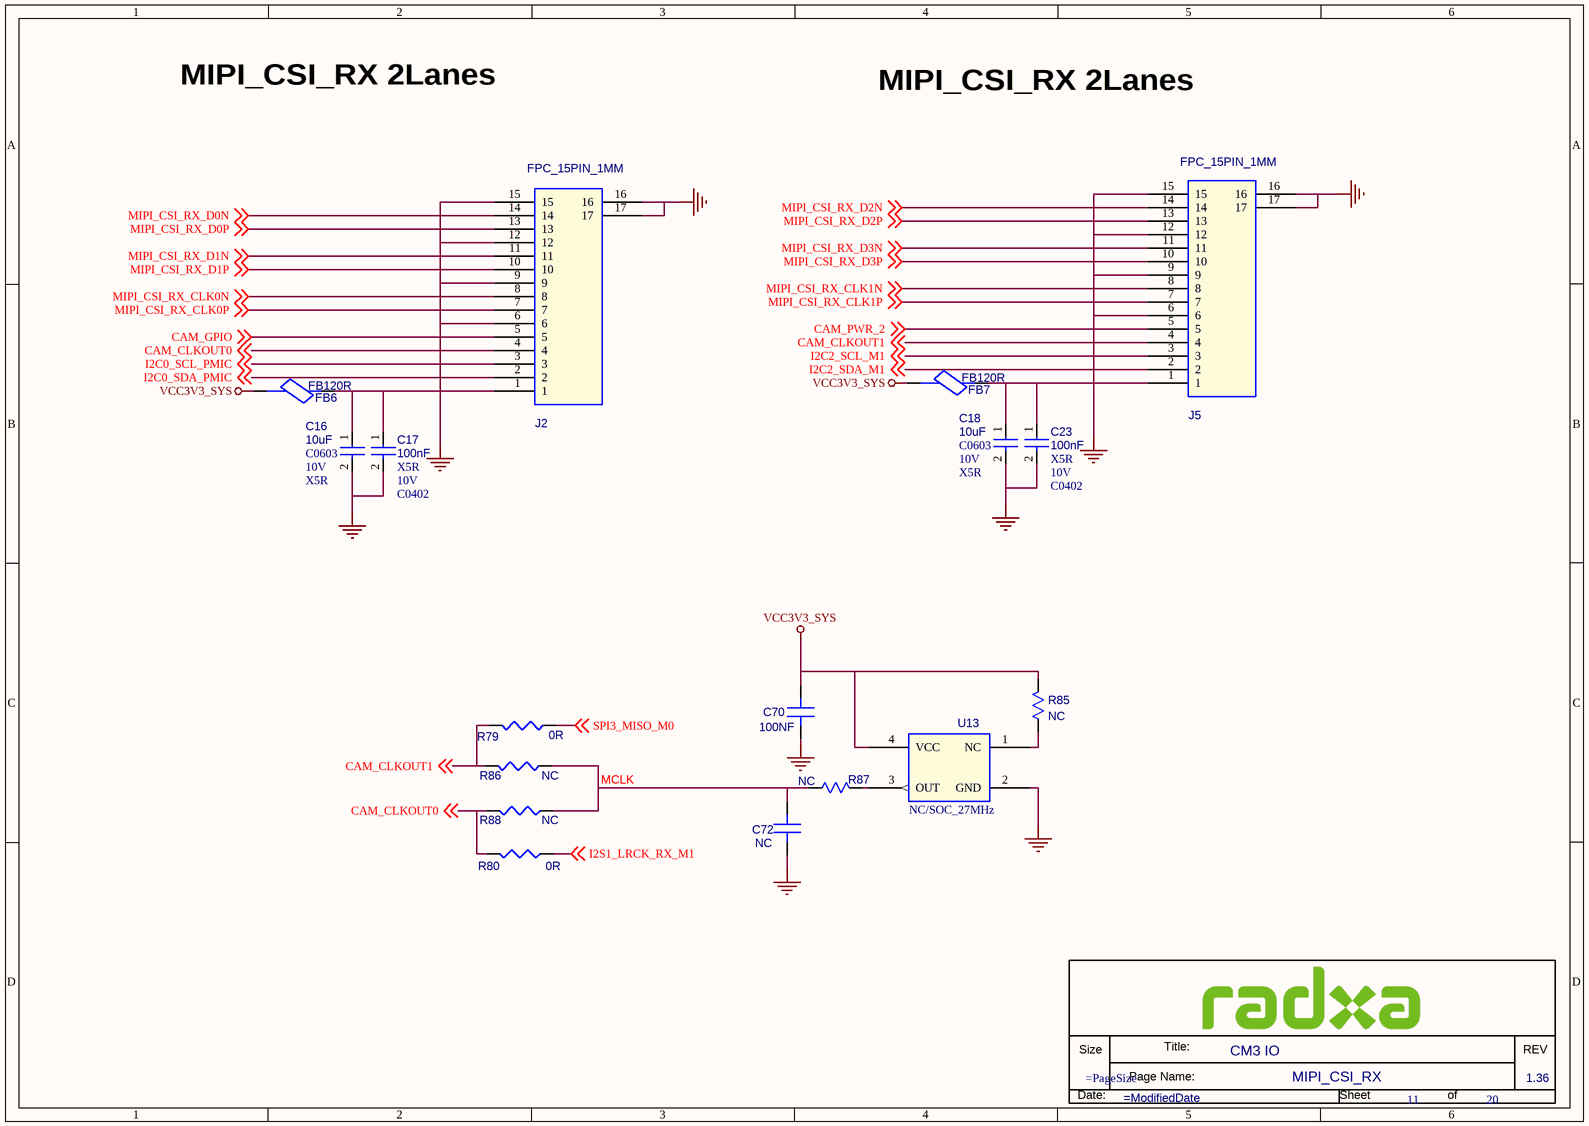
[diagram p9: 11.MIPI_CSI_RX.SchDoc]

### Parts
(Parts that share a designator on the sheet are numbered #1, #2 ... from top to bottom, then left to right.)
*#10  Doc: MIPI_CSI_RX  RevCode: 1.36  Title: CM3 IO  Page Number: 11  Page Count: 20  (hidden comment: radxa_1010)  (graphical)
C16  10uF  Voltage: 10V  Dielectric: X5R  [C0603]
C17  100nF  Voltage: 10V  Dielectric: X5R  [C0402]
C18  10uF  Voltage: 10V  Dielectric: X5R  [C0603]
C23  100nF  Voltage: 10V  Dielectric: X5R  [C0402]
C70  100NF  [C0402]
C72  NC  [C0402]
FB6  FB120R  [R0402]
FB7  FB120R  [R0402]
J2  FPC_15PIN_1MM  [FPC_15PIN_1MM]
J5  FPC_15PIN_1MM  [FPC_15PIN_1MM]
R79  0R  [R0402]
R80  0R  [R0402]
R85  NC  [R0402]
R86  NC  [R0402]
R87  NC  [R0402]
R88  NC  [R0402]
U13  NC/SOC_27MHz  [CRY4_3R20X2R50X0R80]

### Nets
GND: C16.2 C17.2 C18.2 C23.2 C70.2 C72.2 J2.6 J2.9 J2.12 J2.15 J2.16 J2.17 J5.6 J5.9 J5.12 J5.15 J5.16 J5.17 U13.2(GND)
VCC3V3_SYS: C70.1 FB6.1 FB7.1 R85.2 U13.4(VCC)
CAM_CLKOUT0: J2.4 R80.1 R88.2 ; off-sheet CAM_CLKOUT0
CAM_CLKOUT1: J5.4 R79.1 R86.2 ; off-sheet CAM_CLKOUT1
CAM_GPIO: J2.5 ; off-sheet CAM_GPIO
CAM_PWR_2: J5.5 ; off-sheet CAM_PWR_2
I2C0_SCL_PMIC: J2.3 ; off-sheet I2C0_SCL_PMIC
I2C0_SDA_PMIC: J2.2 ; off-sheet I2C0_SDA_PMIC
I2C2_SCL_M1: J5.3 ; off-sheet I2C2_SCL_M1
I2C2_SDA_M1: J5.2 ; off-sheet I2C2_SDA_M1
I2S1_LRCK_RX_M1: R80.2 ; off-sheet I2S1_LRCK_RX_M1
MCLK: C72.1 R86.1 R87.2 R88.1
MIPI_CSI_RX_CLK0N: J2.8 ; off-sheet MIPI_CSI_RX_CLK0N
MIPI_CSI_RX_CLK0P: J2.7 ; off-sheet MIPI_CSI_RX_CLK0P
MIPI_CSI_RX_CLK1N: J5.8 ; off-sheet MIPI_CSI_RX_CLK1N
MIPI_CSI_RX_CLK1P: J5.7 ; off-sheet MIPI_CSI_RX_CLK1P
MIPI_CSI_RX_D0N: J2.14 ; off-sheet MIPI_CSI_RX_D0N
MIPI_CSI_RX_D0P: J2.13 ; off-sheet MIPI_CSI_RX_D0P
MIPI_CSI_RX_D1N: J2.11 ; off-sheet MIPI_CSI_RX_D1N
MIPI_CSI_RX_D1P: J2.10 ; off-sheet MIPI_CSI_RX_D1P
MIPI_CSI_RX_D2N: J5.14 ; off-sheet MIPI_CSI_RX_D2N
MIPI_CSI_RX_D2P: J5.13 ; off-sheet MIPI_CSI_RX_D2P
MIPI_CSI_RX_D3N: J5.11 ; off-sheet MIPI_CSI_RX_D3N
MIPI_CSI_RX_D3P: J5.10 ; off-sheet MIPI_CSI_RX_D3P
SPI3_MISO_M0: R79.2 ; off-sheet SPI3_MISO_M0
NetC16_1: C16.1 C17.1 FB6.2 J2.1
NetC18_1: C18.1 C23.1 FB7.2 J5.1
NetR85_1: R85.1 U13.1(NC)
NetR87_1: R87.1 U13.3(OUT)

### Notes on the sheet
- MIPI_CSI_RX 2Lanes
- (in symbol radxa_1010) Title:; Size; REV; Page Name:; Date:; Sheet; of

### Library data of the parts
C16 = CAP NP: cap,10.00uF,+/-10%,10V,X5R,C0603; Part Reference: C16; Manufacturer PN: C1608X5R1A106K080AC; Manufacturer: TDK; Tolerance: 10%; Priority: A; PCB Footprint: C0603; Value: 10uF; Created by: JJJ; Part Type: C0603; RK PN: C1608X5R1A106K080AC
C17 = CAP NP: cap,100.00nF,+/-10%,10V,X5R,C0402; Part Reference: C17; Manufacturer: TDK; RK PN: C1005X5R1A104K050BA; Priority: A; Tolerance: 10%; PCB Footprint: C0402; Value: 100nF; Part Type: C0402; Manufacturer PN: C1005X5R1A104K050BA; Created by: JJJ
C18 = CAP NP: cap,10.00uF,+/-10%,10V,X5R,C0603; Part Reference: C18; Manufacturer PN: C1608X5R1A106K080AC; Manufacturer: TDK; Tolerance: 10%; Priority: A; PCB Footprint: C0603; Value: 10uF; Created by: JJJ; Part Type: C0603; RK PN: C1608X5R1A106K080AC
C23 = CAP NP: cap,100.00nF,+/-10%,10V,X5R,C0402; Part Reference: C23; Manufacturer: TDK; RK PN: C1005X5R1A104K050BA; Priority: A; Tolerance: 10%; PCB Footprint: C0402; Value: 100nF; Part Type: C0402; Manufacturer PN: C1005X5R1A104K050BA; Created by: JJJ
C70 = C: 贴片陶瓷电容 0402 X5R 1uF±10% 16V; PARTS: 1; Part Reference: C70; Part Number: 823030105005; OriginalSymbolOrigin: (0,30); PKG_TYPE: CAP2-100-250; LEVEL: STD; PINSWAP: (A,B); Approved: 已承认; Grade: B; ROOM: DVDD_MEDIA; Value: 100NF; Part Type: 电容; PCB Footprint: C0402
C72 = C: 贴片陶瓷电容 0402 NPO 10pF±5% 50V; PARTS: 1; Part Reference: C72; Part Number: 823060100001; OriginalSymbolOrigin: (0,30); PKG_TYPE: CAP2-100-250; LEVEL: STD; PINSWAP: (A,B); Approved: 已承认; Grade: B; ROOM: AN41908; Value: NC; Part Type: 电容; PCB Footprint: C0402
FB6 = FB: 贴片磁珠 0603 600Ω±25% 1000mA 铁氧体叠片 UPZ1608E601-1R0T 顺络; Part Reference: FB6; Part Number: 832026000003; Approved: 已承认; Grade: D; Value: FB120R; Part Type: 磁珠; PCB Footprint: R0402
FB7 = FB: 贴片磁珠 0603 600Ω±25% 1000mA 铁氧体叠片 UPZ1608E601-1R0T 顺络; Part Reference: FB7; Part Number: 832026000003; Approved: 已承认; Grade: D; Value: FB120R; Part Type: 磁珠; PCB Footprint: R0402
J2 = CON15_1: Part Reference: J2; Value: FPC_15PIN_1MM; PCB Footprint: FPC_15PIN_1MM
J5 = CON15_2: Part Reference: J5; Value: FPC_15PIN_1MM; PCB Footprint: FPC_15PIN_1MM
R79 = RESISTOR_0: 通用厚膜电阻,100R,+/-5%,R0402,1/16W.; Part Reference: R79; Manufacturer: YAGEO; RK PN: RC0402JR-07100RL; Priority: A; Tolerance: 5%; Wattage: 1/16W; Value: 0R; Part Type: 通用厚膜电阻; Manufacturer PN: RC0402JR-07100RL; Created by: YTL; PCB Footprint: R0402
R80 = RESISTOR_0: 通用厚膜电阻,100R,+/-5%,R0402,1/16W.; Part Reference: R80; Manufacturer: YAGEO; RK PN: RC0402JR-07100RL; Priority: A; Tolerance: 5%; Wattage: 1/16W; Value: 0R; Part Type: 通用厚膜电阻; Manufacturer PN: RC0402JR-07100RL; Created by: YTL; PCB Footprint: R0402
R85 = R: 贴片电阻 0805 0Ω±5%; PARTS: 1; Part Reference: R85; Part Number: 811040000001; LEVEL: STD; PKG_TYPE: 2; PINSWAP: (A,B); OriginalSymbolOrigin: (10,20); ROOM: DC-IRIS; Grade: B; Approved: 已承认; Value: NC; Part Type: 电阻; PCB Footprint: R0402
R86 = RESISTOR_0: 通用厚膜电阻,100R,+/-5%,R0402,1/16W.; Part Reference: R86; Manufacturer: YAGEO; RK PN: RC0402JR-07100RL; Priority: A; Tolerance: 5%; Wattage: 1/16W; Value: NC; Part Type: 通用厚膜电阻; Manufacturer PN: RC0402JR-07100RL; Created by: YTL; PCB Footprint: R0402
R87 = R: 贴片电阻 0402 33Ω±5%; PARTS: 1; Part Reference: R87; Part Number: 811020330001; LEVEL: STD; PKG_TYPE: 2; PINSWAP: (A,B); OriginalSymbolOrigin: (10,20); ROOM: AN41908; Grade: B; Approved: 已承认; Value: NC; Part Type: 电阻; PCB Footprint: R0402
R88 = RESISTOR_0: 通用厚膜电阻,100R,+/-5%,R0402,1/16W.; Part Reference: R88; Manufacturer PN: RC0402JR-07100RL; Manufacturer: YAGEO; Wattage: 1/16W; Tolerance: 5%; Priority: A; Value: NC; Created by: YTL; Part Type: 通用厚膜电阻; RK PN: RC0402JR-07100RL; PCB Footprint: R0402
U13 = OSC_4PIN_1: 贴片钟振 27.000MHz ±30PPM  3.3V 3.2x2.5mm; Part Reference: U13; Part Number: 841042700403; Grade: B; Approved: 已承认; ROOM: AN41908; Value: NC/SOC_27MHz; Part Type: 钟振; PCB Footprint: CRY4_3R20X2R50X0R80
*#10 = radxa_1010: Page Create Date: March  8, 1995; Page Size: =PageSize; Page Modify Date: =ModifiedDate